# EAGLE design attenuator (EAGLE 7.4.0)
USB Attenuator FT245*
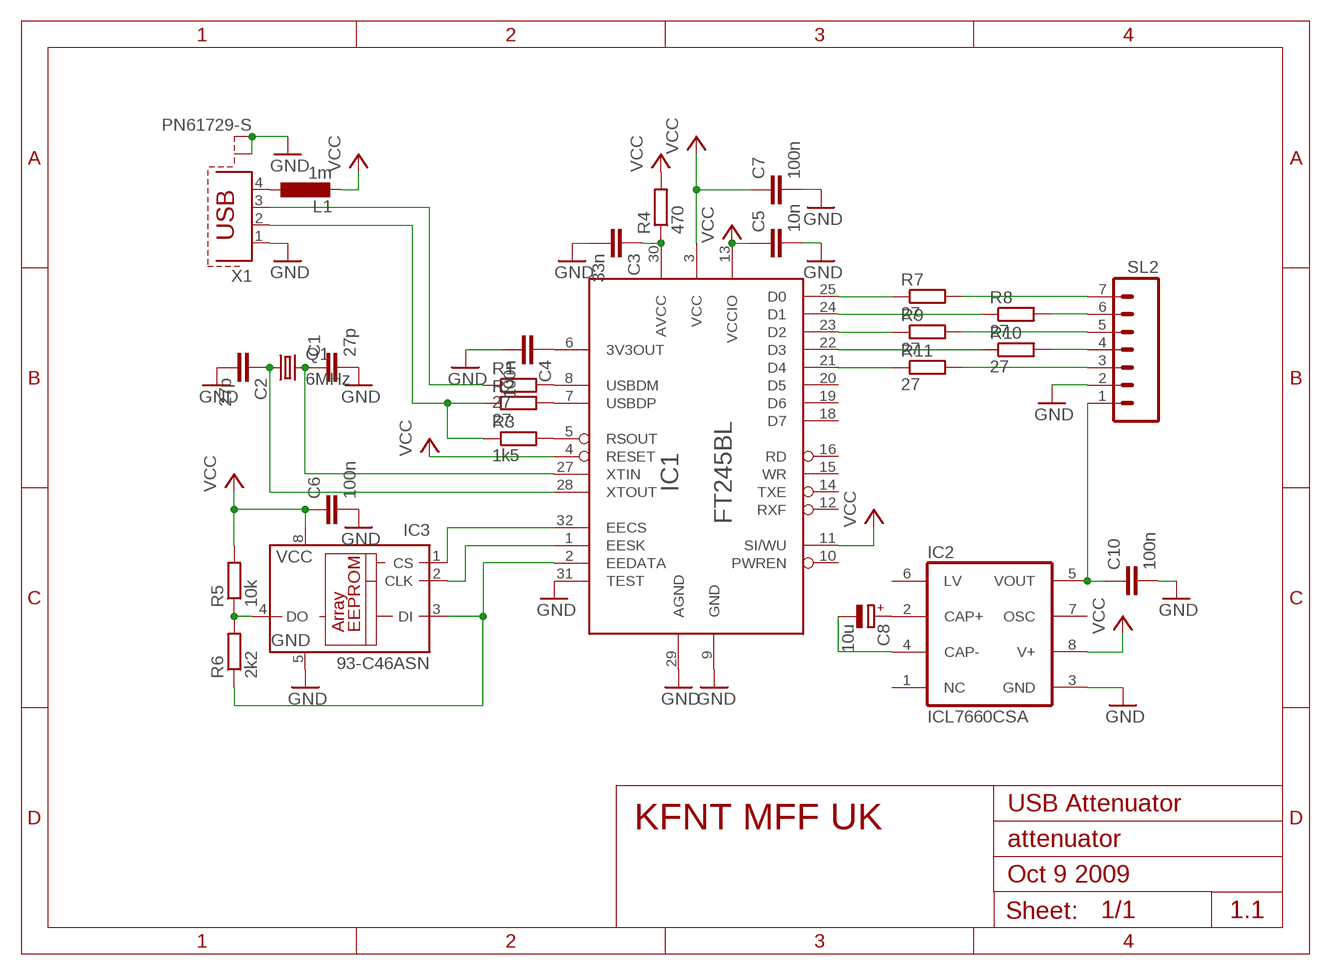
[diagram p0: schematic, sheet 1]

## Parts
C1  27p  C-EUC0805  [C0805]
C2  27p  C-EUC0805  [C0805]
C3  33n  C-EUC0805  [C0805]
C4  100n  C-EUC0805  [C0805]
C5  10n  C-EUC0805  [C0805]
C6  100n  C-EUC0805  [C0805]
C7  100n  C-EUC0805  [C0805]
C8  10u  CPOL-EUSMCC  [SMC_C]
C10  100n  C-EUC0805  [C0805]
IC1  FT245BL  [LQFP32]
IC2  ICL7660CSA  [SO08]
IC3  93-C46ASN  [SO-08]
L1  1m  L-EU0805  [M0805]
Q1  6MHz  CRYSTALHC49U70  [HC49U70]
R1  27  R-EU_M0805  [M0805]
R2  27  R-EU_M0805  [M0805]
R3  1k5  R-EU_M0805  [M0805]
R4  470  R-EU_M0805  [M0805]
R5  10k  R-EU_M0805  [M0805]
R6  2k2  R-EU_M0805  [M0805]
R7  27  R-EU_M0805  [M0805]
R8  27  R-EU_M0805  [M0805]
R9  27  R-EU_M0805  [M0805]
R10  27  R-EU_M0805  [M0805]
R11  27  R-EU_M0805  [M0805]
SL2  MA07  [07PA]
X1  PN61729-S  [PN61729-S]

## Nets
GND: C1.2 C2.2 C3.2 C4.2 C5.2 C6.2 C7.2 C10.2 IC1.9(GND) IC1.29(AGND) IC1.31(TEST) IC2.3(GND) IC3.5(GND) SL2.2 X1.1 X1.S1 X1.S2
N$1: C1.1 IC1.27(XTIN) Q1.2
N$2: C2.1 IC1.28(XTOUT) Q1.1
N$3: IC1.32(EECS) IC3.1(CS)
N$4: IC1.1(EESK) IC3.2(CLK)
N$5: IC1.2(EEDATA) IC3.3(DI) R6.1
N$6: R7.2 SL2.7
N$7: IC3.4(DO) R5.1 R6.2
N$8: C8.+ IC2.2(CAP+)
N$9: R2.1 R3.1 X1.2
N$10: R1.1 X1.3
N$11: IC1.7(USBDP) R2.2
N$12: IC1.8(USBDM) R1.2
N$13: C4.1 IC1.6(3V3OUT)
N$14: C8.- IC2.4(CAP-)
N$15: L1.1 X1.4
N$17: R8.2 SL2.6
N$18: R9.2 SL2.5
N$19: IC1.22(D3) R10.1
N$20: IC1.21(D4) R11.1
N$21: IC1.25(D0) R7.1
N$22: IC1.24(D1) R8.1
N$23: IC1.23(D2) R9.1
N$24: R10.2 SL2.4
N$25: R11.2 SL2.3
N$26: C10.1 IC2.5(VOUT) SL2.1
N$28: C3.1 IC1.30(AVCC) R4.1
RSOUT: IC1.5(RSOUT) R3.2
VCC: C5.1 C6.1 C7.1 IC1.3(VCC) IC1.4(RESET) IC1.11(SI/WU) IC1.13(VCCIO) IC2.8(V+) IC3.8(VCC) L1.2 R4.2 R5.2
Unconnected: IC1.10(PWREN) IC1.12(RXF) IC1.14(TXE) IC1.15(WR) IC1.16(RD) IC1.18(D7) IC1.19(D6) IC1.20(D5) IC2.1(NC) IC2.6(LV) IC2.7(OSC)

## Power pins joined to a net without a drawn wire
GND: IC1.17(GND)
VCC: IC1.26(VCC)

## Library data of the parts
C1-C7 C10 = rcl:C-EU: CAPACITOR, European symbol
C8 = rcl:CPOL-EU: POLARIZED CAPACITOR, European symbol
IC1 = ftdichip:FT245BL
IC2 = maxim:ICL7660CSA: VOLTAGE CONVERTER
IC3 = microchip:93-*: Serial EEPROM 512 x 8 bit/256 x 16 bit/1 K/4 K, 5.0 V, Microwire
L1 = rcl:L-EU: INDUCTOR, European symbol
Q1 = crystal:CRYSTAL: CRYSTAL
R1-R11 = rcl:R-EU_: RESISTOR, European symbol
SL2 = con-amp-quick:MA07: AMP QUICK CONNECTOR
X1 = con-berg:PN61729-S: BERG USB connector; OC_FARNELL: unknown; OC_NEWARK: unknown

## Board
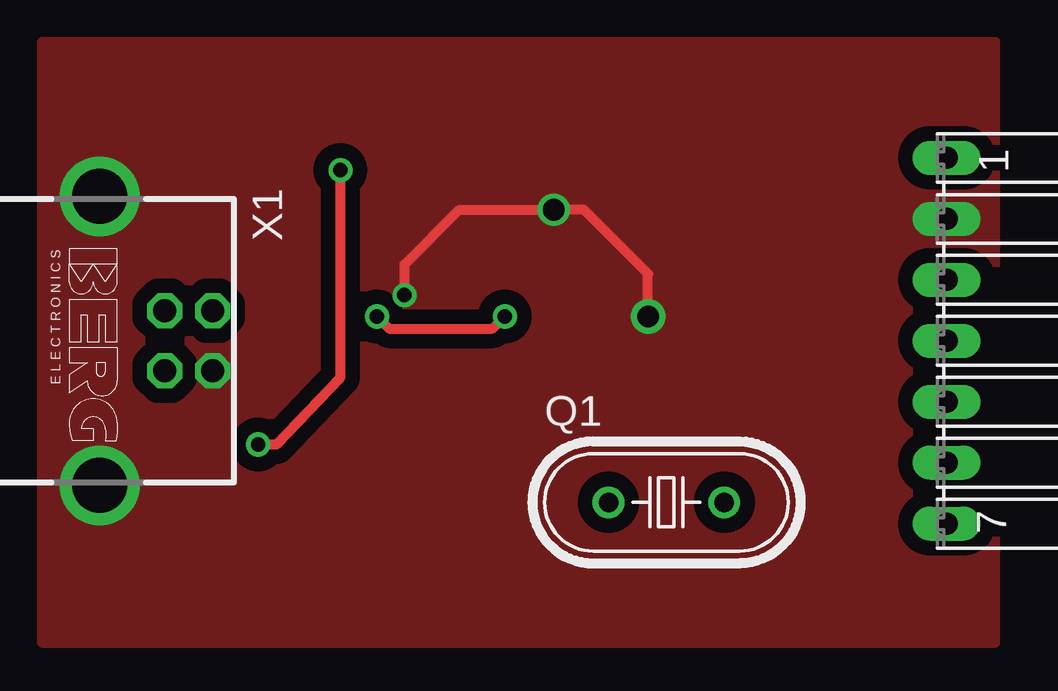
[diagram p1: board, top side]
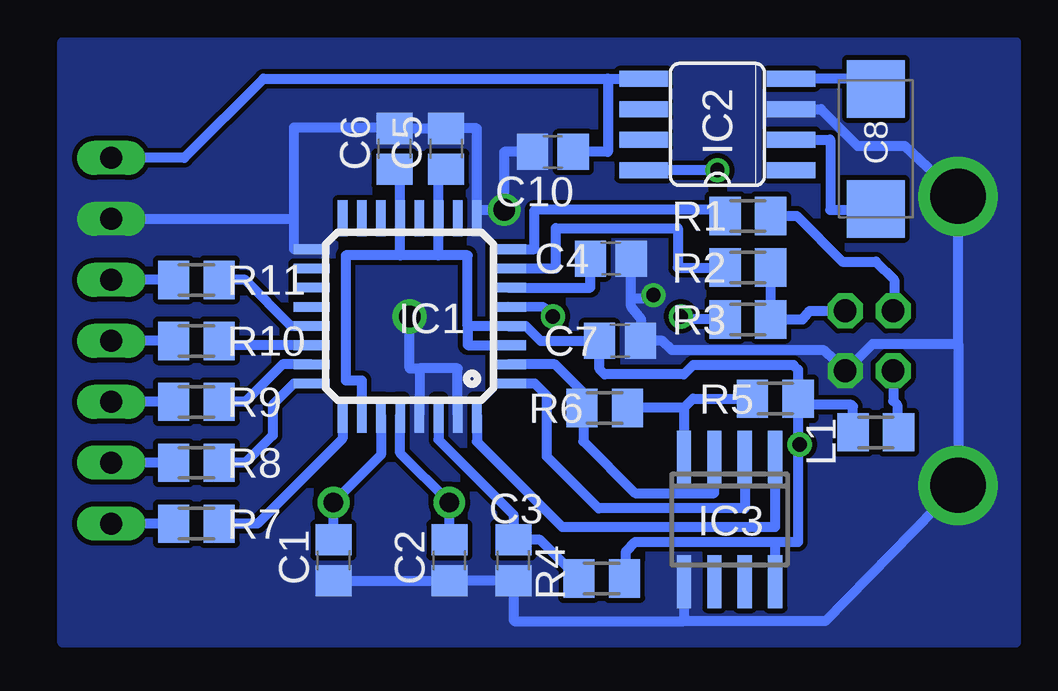
[diagram p2: board, bottom side, seen from below]

No outline drawn. Coordinates in mm, seen from the top.
Copper layers (1*16): Top 0.035mm / dielectric 1.5mm / Bottom 0.035mm
Design rules "default": minimum track width 10mil, minimum drill 24mil, track to track 8mil, track to pad 8mil, pad to pad 8mil, via to via 8mil, smd to smd 8mil, copper to edge 40mil, drill to drill 8mil, minimum pad ring 10mil, minimum via ring 8mil, stop-mask expansion 4mil, vias tented up to drill 0mil, thermal gap 10mil

### Footprints (pad centres in the part's own frame; a part is rotated, then mirrored left to right if it is on the bottom)
C0805 = smd 1.3 x 1.5: 1 -0.85,0; 2 0.85,0
SMC_C = smd 2.4 x 2.4: + -2.5,0; - 2.5,0
LQFP32 = smd 1.5 x 0.4: 1 -4.1,2.8; 2 -4.1,2; 3 -4.1,1.2; 4 -4.1,0.4; 5 -4.1,-0.4; 6 -4.1,-1.2; 7 -4.1,-2; 8 -4.1,-2.8; 17 4.1,-2.8; 18 4.1,-2; 19 4.1,-1.2; 20 4.1,-0.4; 21 4.1,0.4; 22 4.1,1.2; 23 4.1,2; 24 4.1,2.8 | smd 0.4 x 1.5: 9 -2.8,-4.1; 10 -2,-4.1; 11 -1.2,-4.1; 12 -0.4,-4.1; 13 0.4,-4.1; 14 1.2,-4.1; 15 2,-4.1; 16 2.8,-4.1; 25 2.8,4.1; 26 2,4.1; 27 1.2,4.1; 28 0.4,4.1; 29 -0.4,4.1; 30 -1.2,4.1; 31 -2,4.1; 32 -2.8,4.1
SO08 = smd 0.66 x 2.032: 1 -1.905,-3.073; 2 -0.635,-3.073; 3 0.635,-3.073; 4 1.905,-3.073; 5 1.905,3.073; 6 0.635,3.073; 7 -0.635,3.073; 8 -1.905,3.073
SO-08 = smd 0.6 x 2.2: 1 -1.905,-2.6; 2 -0.635,-2.6; 3 0.635,-2.6; 4 1.905,-2.6; 5 1.905,2.6; 6 0.635,2.6; 7 -0.635,2.6; 8 -1.905,2.6
M0805 = smd 1.3 x 1.6: 1 -0.95,0; 2 0.95,0
HC49U70 = drill 0.813: 1 -2.413,0; 2 2.413,0
07PA = drill 0.914 long: 1 -7.62,0; 2 -5.08,0; 3 -2.54,0; 4 0,0; 5 2.54,0; 6 5.08,0; 7 7.62,0
PN61729-S = drill 0.95 octagon: 1 1.25,4.71; 2 -1.25,4.71; 3 -1.25,2.71; 4 1.25,2.71 | drill 2.3 pad 2.9: S1 -6.02,0; S2 6.02,0

### Placement (x,y rotation side)
C1  36.96,4.06 270 bottom
C2  32.13,4.06 270 bottom
C3  29.46,4.06 270 bottom
C4  25.4,16.64 0 bottom
C5  32.26,21.21 90 bottom
C6  34.42,21.21 90 bottom
C7  25.02,13.21 0 bottom
C8  14.35,21.21 90 bottom
C10  27.81,21.08 180 bottom
IC1  33.78,14.22 180 bottom
IC2  20.95,22.23 90 bottom
IC3  20.45,5.77 180 bottom
L1  14.35,9.4 180 bottom
Q1  34.54,6.48 0 top
R1  19.68,18.41 180 bottom
R2  19.68,16.26 180 bottom
R3  19.68,14.1 180 bottom
R4  25.78,3.3 0 bottom
R5  18.54,10.79 0 bottom
R6  25.65,10.41 0 bottom
R7  42.67,5.59 180 bottom
R8  42.67,8.13 180 bottom
R9  42.67,10.67 180 bottom
R10  42.67,13.21 180 bottom
R11  42.67,15.75 180 bottom
SL2  46.23,13.21 270 top
X1  10.92,13.21 270 top

### Tracks (layer width: path | path; a pad name or v marks a point on that pad's centre or on a via)
GND  (via drill 0.6, 0.9, 0.9 pad 1.42)
  Top 0.406: v33.78,14.22 33.78,16 31.11,18.67 v29.84,18.67 25.91,18.67 23.62,16.38 v23.62,15.11
  Bottom 0.406: IC1.31 31.78,12.06 33.38,12.06 | v33.78,14.22 33.78,12.06 33.38,12.06 | 33.38,12.06 IC1.29 | C1.2 C2.2 C3.2 29.43,3.21 29.43,1.52 22.35,1.52 | IC3.5 22.35,1.52 | IC1.17 38.61,17.02 38.61,18.29 | 38.61,18.29 38.61,22.1 35.05,22.1 C6.2 C5.2 30.98,22.06 30.98,18.67 | SL2.2 38.61,18.29 | IC1.9 30.98,18.67 | 30.98,18.67 v29.84,18.67 29.84,21.08 C10.2 | 24.55,14.99 C4.2 | 22.35,1.52 16.46,1.52 X1.S2 10.92,13.08 | 18.16,22.86 IC2.3 16.64,22.86 15.11,21.34 13.16,21.34 X1.S1 10.92,13.08 | 24.55,14.99 23.62,14.99 | 23.62,14.99 23.75,15.11 | v23.62,15.11 23.62,14.99 | 24.55,14.99 24.55,14.64 24.13,14.1 24.13,13.25 C7.2 23.24,13.21 22.86,12.83 16.54,12.83 X1.1 15.6,11.96 14.48,13.08 10.92,13.08
  pour Bottom (no thermals): 8.51,25.65 8.51,0.64 48.26,0.64 48.26,25.65
  pour Top (isolate 0.61, no thermals): 8.51,25.65 8.51,0.64 48.26,0.64 48.26,25.65
N$1
  Bottom 0.406: C1.1 Q1.2 34.98,8.45 IC1.27
N$2
  Bottom 0.406: C2.1 Q1.1 34.18,8.53 IC1.28
N$3
  Bottom 0.406: IC1.32 30.98,9.01 27.43,5.46 18.54,5.46 IC3.1
N$4
  Bottom 0.406: 19.81,8 IC3.2 19.81,6.22 25.91,6.22 28.07,8.38 28.07,10.92 28.57,11.42 IC1.1
N$5
  Bottom 0.406: IC1.2 27.72,12.22 26.54,11.05 R6.1 26.54,10.73 26.54,9.02 24.38,6.86 21.08,6.86 IC3.3
N$6
  Bottom 0.406: R7.2 SL2.7
N$7
  Bottom 0.406: 22.35,10.41 R6.2 | 22.35,10.41 IC3.4 | 22.35,10.41 21.97,10.79 R5.1
N$8
  Bottom 0.406: IC2.2 16.26,21.59 16.26,18.67 14.35,18.67 C8.+
N$9
  Bottom 0.406: R2.1 R3.1 17.4,14.1 17.1,14.46 X1.2
N$10
  Bottom 0.406: R1.1 17.65,18.41 15.75,16.51 14.35,16.51 13.59,15.75 13.59,14.41 X1.3
N$11
  Bottom 0.406: IC1.7 27.69,16.22 27.69,17.91 22.61,17.91 22.61,16.26 R2.2
N$12
  Bottom 0.406: IC1.8 28.57,17.02 28.57,18.67 20.64,18.67 R1.2
N$13
  Bottom 0.406: IC1.6 26.25,15.42 C4.1
N$14
  Bottom 0.406: C8.- 14.35,24.13 IC2.4
N$15
  Bottom 0.406: X1.4 13.63,10.71 13.46,10.54 13.46,9.46 L1.1
N$17
  Bottom 0.406: R8.2 SL2.6
N$18
  Bottom 0.406: R9.2 SL2.5
N$19
  Bottom 0.406: IC1.22 41.6,13.02 41.66,13.08 R10.1
N$20
  Bottom 0.406: IC1.21 38.72,13.82 40.64,15.75 R11.1
N$21
  Bottom 0.406: IC1.25 36.58,9.14 40.13,5.59 R7.1
N$22
  Bottom 0.406: IC1.24 38.61,11.42 39.5,10.54 39.5,9.27 40.64,8.13 R8.1
N$23
  Bottom 0.406: IC1.23 39.08,12.22 40.64,10.67 R9.1
N$24
  Bottom 0.406: R10.2 SL2.4
N$25
  Bottom 0.406: R11.2 SL2.3
N$26
  Bottom 0.406: SL2.1 43.18,20.83 39.88,24.13 25.53,24.13 | 25.53,24.13 IC2.5 | 25.53,24.13 25.53,21.08 C10.1
N$28
  Bottom 0.406: R4.1 28.34,4.91 C3.1 29.46,5.97 32.58,9.09 IC1.30
RSOUT  (via drill 0.6)
  Top 0.406: v22.48,14.22 22.99,13.72 27.3,13.72 v27.81,14.22
  Bottom 0.406: R3.2 22.48,14.1 22.61,13.97 v22.48,14.22 | v27.81,14.22 28.19,14.61 IC1.5
VCC  (via drill 0.6)
  Top 0.406: v17.53,8.89 18.29,8.89 20.95,11.68 v20.95,20.32
  Bottom 0.406: IC1.3 31.37,13.02 31.37,13.82 | 31.37,13.82 IC1.4 28.94,13.82 28.32,13.21 C7.1 25.87,12.03 25.65,11.81 22.35,11.81 21.97,12.19 17.78,12.19 17.59,12 R5.2 | 31.37,13.82 31.37,16.76 32.58,16.76 | 32.58,16.76 IC1.11 32.58,20.36 C5.1 | 34.18,16.76 IC1.13 34.18,20.36 C6.1 | 32.58,16.76 34.18,16.76 | IC1.26 35.78,11.56 36.45,11.56 36.45,16.76 34.18,16.76 | R4.2 24.77,3.05 24.77,4.45 24.38,4.83 18.54,4.83 | 18.54,4.83 17.59,4.83 17.59,8.76 | v17.53,8.89 17.59,8.76 | v20.95,20.32 IC2.8 | R5.2 17.59,8.76 | IC3.8 18.54,4.83 | L1.2 15.3,10.47 15.37,10.54 17.34,10.54 R5.2